# EAGLE design 3wire-1602-v0 (EAGLE 5.07)
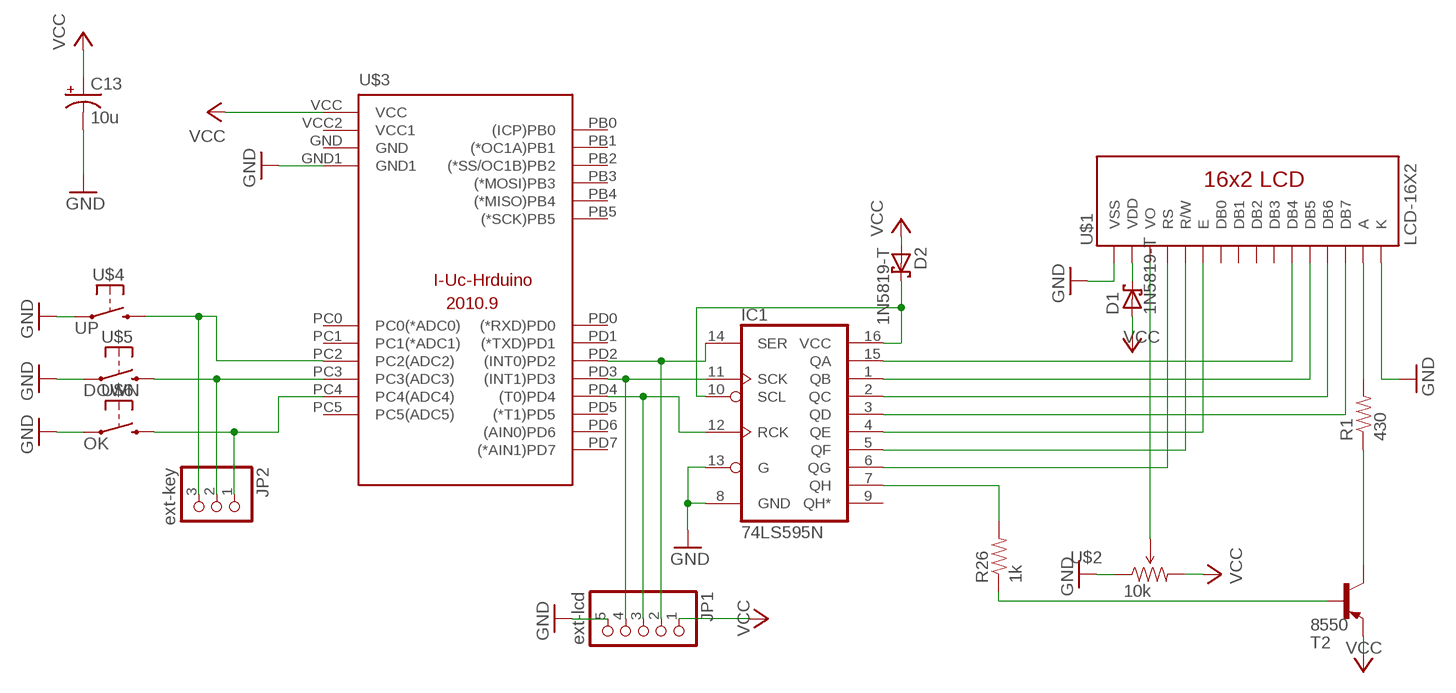
[diagram p0: schematic, sheet 1]

## Parts
C13  10u  CAP_POLPTH1  [CPOL-RADIAL-100UF-25V]
D1  1N5819-T  [DO41-7.6]
D2  1N5819-T  [DO41-7.6]
IC1  74LS595N  [DIL16]
JP1  ext-lcd  PINHD-1X5/90  [1X05/90]
JP2  ext-key  PINHD-1X3/90-LOCK  [1X03/90_LOCK]
R1  430  RESISTOR1/4W  [AXIAL-0.3]
R26  1k  RESISTOR0805  [0805]
T2  8550  -PNP-TO92-EBC  [TO92-EBC]
U$1  LCD-16X2  [LCD-16X2]
U$2  10k  TRIMPOTPTH  [TRIM_POT_PTH]
U$3  I-UC-V0/EXT-V0  [I-UC-V0-EXT-V0]
U$4  UP  TACT_SWITCH-2-PTH  [ALPS-SKHV]
U$5  DOWN  TACT_SWITCH-2-PTH  [ALPS-SKHV]
U$6  OK  TACT_SWITCH-2-PTH  [ALPS-SKHV]

## Nets
GND: C13.2(-) IC1.8(GND) IC1.13(G) JP1.5 U$1.1(VSS) U$1.16(K) U$2.1(CCW) U$3.GND1 U$4.2 U$5.2 U$6.2
N$1: IC1.15(QA) U$1.11(DB4)
N$2: IC1.1(QB) U$1.12(DB5)
N$3: IC1.2(QC) U$1.13(DB6)
N$4: IC1.3(QD) U$1.14(DB7)
N$5: IC1.4(QE) U$1.6(E)
N$6: IC1.5(QF) U$1.5(R/W)
N$7: IC1.6(QG) U$1.4(RS)
N$8: IC1.7(QH) R26.2
N$10: IC1.14(SER) JP1.2 U$3.PD2((INT0)PD2)
N$11: IC1.11(SCK) JP1.4 U$3.PD3((INT1)PD3)
N$12: IC1.12(RCK) JP1.3 U$3.PD4((T0)PD4)
N$13: JP2.3 U$3.PC2(PC2(ADC2)) U$4.3
N$14: JP2.2 U$3.PC3(PC3(ADC3)) U$5.3
N$15: U$1.3(VO) U$2.2(WIPER)
N$16: R1.P$2 U$1.15(A)
N$17: JP2.1 U$3.PC4(PC4(ADC4)) U$6.3
N$18: D1.C U$1.2(VDD)
N$19: R1.P$1 T2.C
N$21: D2.C IC1.10(SCL) IC1.16(VCC)
N$55: R26.1 T2.B
VCC: C13.1(+) D1.A D2.A JP1.1 T2.E U$2.3(CW) U$3.VCC
Unconnected: IC1.9(QH*) U$1.7(DB0) U$1.8(DB1) U$1.9(DB2) U$1.10(DB3) U$3.GND U$3.PB0((ICP)PB0) U$3.PB1((*OC1A)PB1) U$3.PB2((*SS/OC1B)PB2) U$3.PB3((*MOSI)PB3) U$3.PB4((*MISO)PB4) U$3.PB5((*SCK)PB5) U$3.PC0(PC0(*ADC0)) U$3.PC1(PC1(*ADC1)) U$3.PC5(PC5(ADC5)) U$3.PD0((*RXD)PD0) U$3.PD1((*TXD)PD1) U$3.PD5((*T1)PD5) U$3.PD6((AIN0)PD6) U$3.PD7((*AIN1)PD7) U$3.VCC2(VCC1)

## Library data of the parts
C13 = SparkFun:CAP_POL: Capacitor Polarized These are standard SMD and PTH capacitors. Normally 10uF, 47uF, and 100uF in electrolytic and tantalum varieties. Always verify the external diameter of the through hole cap, it varies with capacity, voltage, and manufacturer. The EIA devices should be standard.
D1 D2 = digital-toy:1N581*: 1.0A SCHOTTKY BARRIER RECTIFIER Source: http://www.diodes.com/datasheets/ds23001.pdf
IC1 = SparkFun:74*595: 8-bit SHIFT REGISTER, output latch
JP1 = pinhead:PINHD-1X5: PIN HEADER
JP2 = digital-toy:PINHD-1X3: PIN HEADER
R1 R26 = digital-toy:RESISTOR: Resistor Basic schematic elements and footprints for 0603, 1206, and PTH 1/10th watt (small) resistors. digital-toy copy vertical mount of axial-0.3 from rcl.lbr : the 0207/xx
T2 = digital-toy:*-PNP-: PNP Transistror
U$1 = digital-toy:LCD-16X2
U$2 = SparkFun:TRIMPOT
U$3 = digital-toy:I-UC-V0
U$4-U$6 = digital-toy:TACT_SWITCH-2

## Board
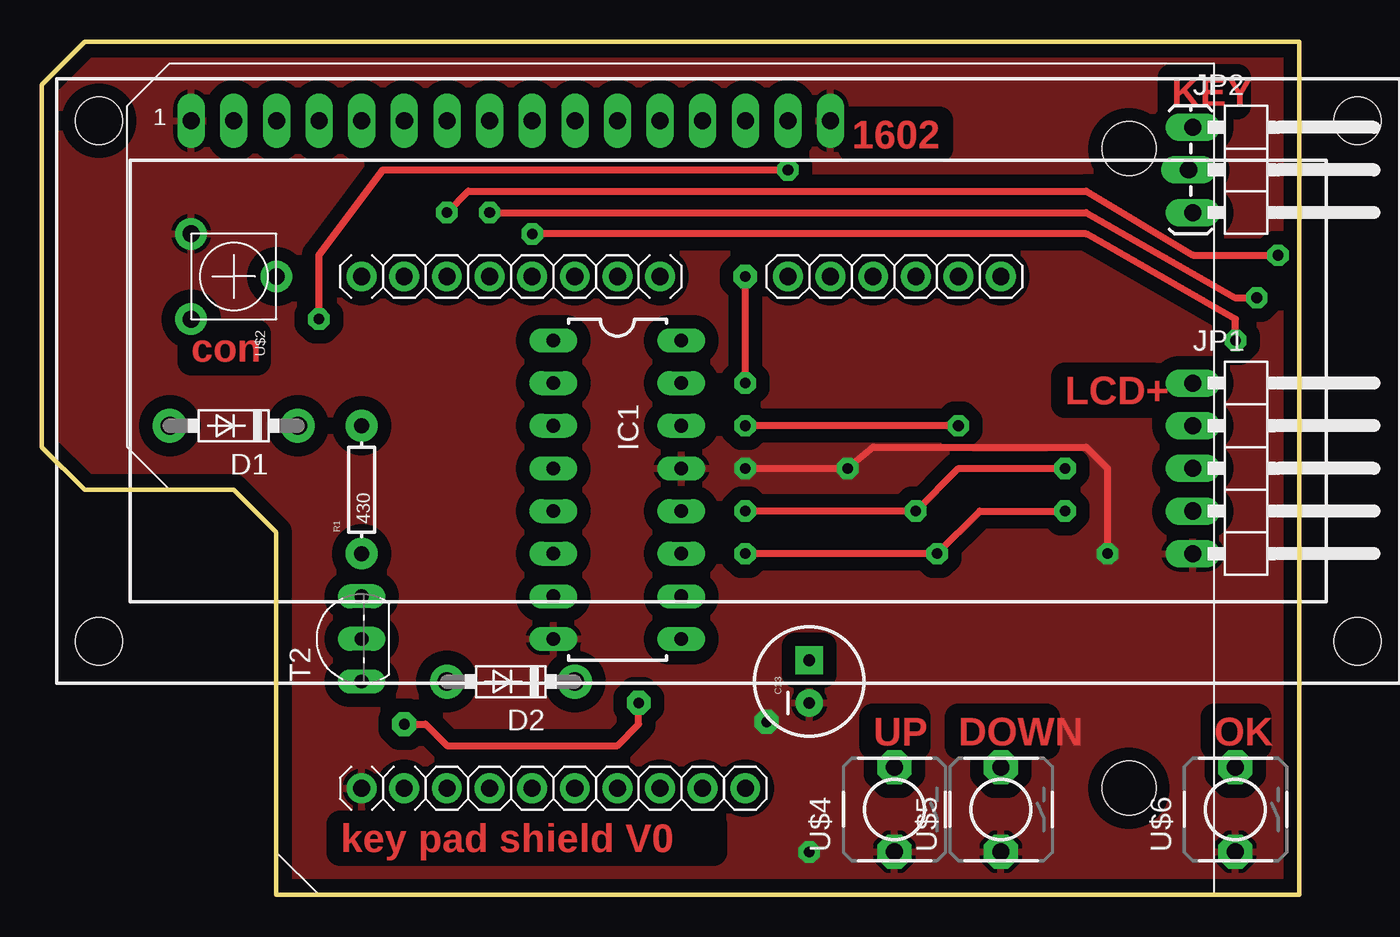
[diagram p1: board, top side]
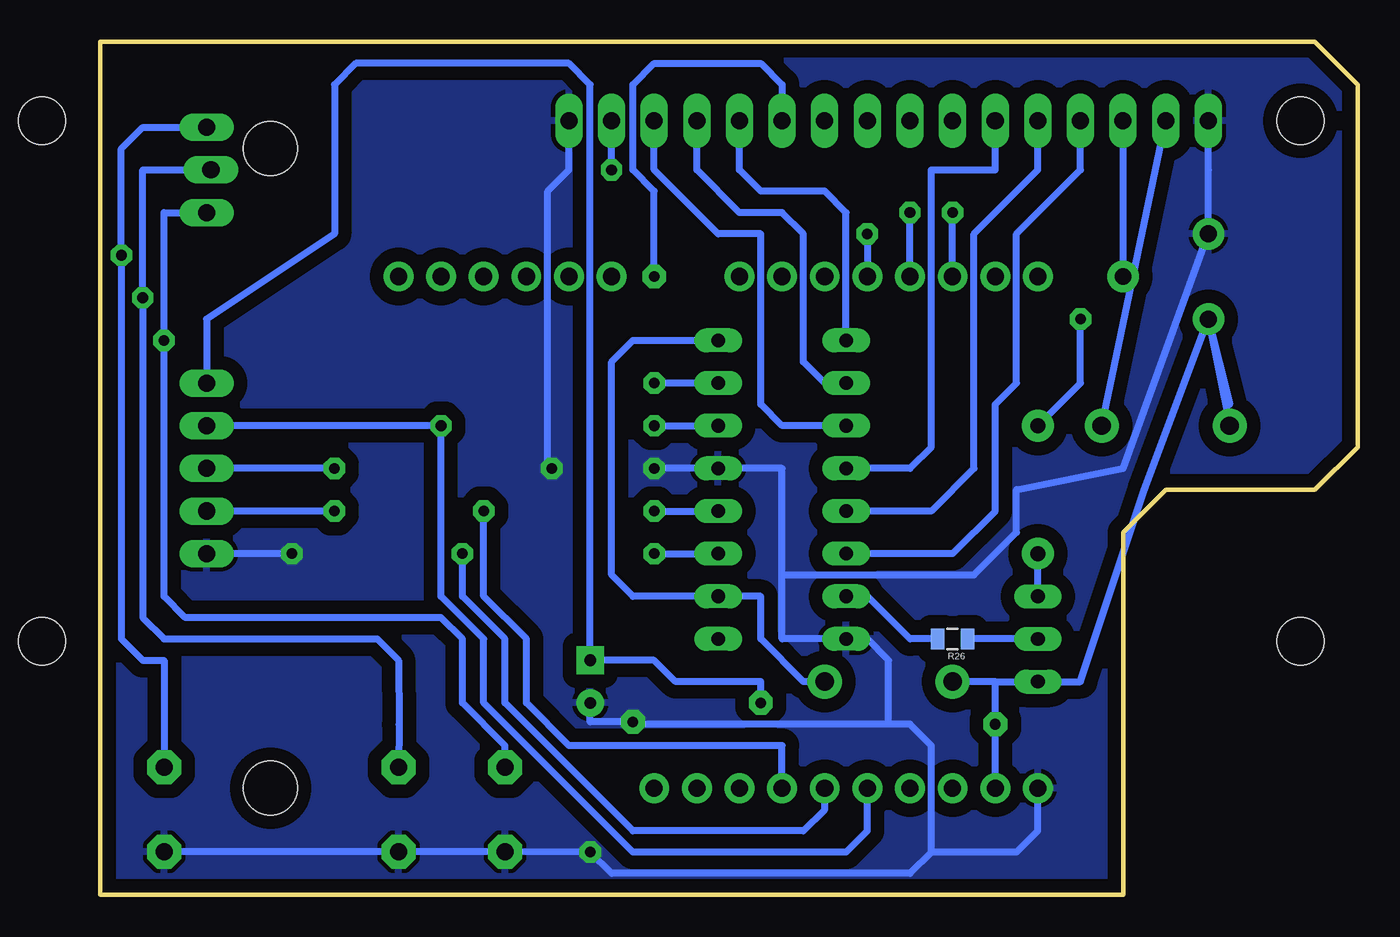
[diagram p2: board, bottom side, seen from below]

Size 74.93 x 50.8 mm. Coordinates in mm from the lower left corner, seen from the top.
Outline: 13.97,0 74.93,0 74.93,50.8 2.54,50.8 0,48.26 0,26.67 2.54,24.13 11.43,24.13 13.97,21.59 13.97,0
Copper layers (1*16): Top 0.035mm / dielectric 1.5mm / Bottom 0.035mm
Design rules "SparkFun": minimum track width 8mil, minimum drill 20mil, track to track 8mil, track to pad 8mil, pad to pad 8mil, via to via 8mil, smd to smd 8mil, copper to edge 10mil, drill to drill 8mil, minimum pad ring 12mil, minimum via ring 10mil, stop-mask expansion 4mil, vias tented up to drill 25mil, thermal gap 10mil

### Footprints (pad centres in the part's own frame; a part is rotated, then mirrored left to right if it is on the bottom)
CPOL-RADIAL-100UF-25V = drill 0.7 pad 1.651 square: 1 1.27,0 | drill 0.7 pad 1.651 round: 2 -1.27,0
DO41-7.6 = drill 1.1 pad 2.032 round: A 3.81,0; C -3.81,0
DIL16 = drill 0.813 long: 1 -8.89,-3.81; 2 -6.35,-3.81; 3 -3.81,-3.81; 4 -1.27,-3.81; 5 1.27,-3.81; 6 3.81,-3.81; 7 6.35,-3.81; 8 8.89,-3.81; 9 8.89,3.81; 10 6.35,3.81; 11 3.81,3.81; 12 1.27,3.81; 13 -1.27,3.81; 14 -3.81,3.81; 15 -6.35,3.81; 16 -8.89,3.81
1X05/90 = drill 1.016 long: 1 -5.08,-3.81; 2 -2.54,-3.81; 3 0,-3.81; 4 2.54,-3.81; 5 5.08,-3.81
1X03/90_LOCK = drill 1.016 long: 1 -2.54,-3.81; 2 0,-4.064; 3 2.54,-3.81
AXIAL-0.3 = drill 0.9 pad 1.88 round: P$1 -3.81,0; P$2 3.81,0
0805 = smd 0.8 x 1.2: 1 -0.9,0; 2 0.9,0
TO92-EBC = drill 0.813 long: B 0,-1.27; C 2.54,-1.27; E -2.54,-1.27
LCD-16X2 = drill 1.016 long: 1 -32,15.5; 2 -29.46,15.5; 3 -26.92,15.5; 4 -24.38,15.5; 5 -21.84,15.5; 6 -19.3,15.5; 7 -16.76,15.5; 8 -14.22,15.5; 9 -11.68,15.5; 10 -9.14,15.5; 11 -6.6,15.5; 12 -4.06,15.5; 13 -1.52,15.5; 14 1.02,15.5; 15 3.56,15.5; 16 6.1,15.5 | hole 2.8: -37.5,15.5; -37.5,-15.5; 37.5,15.5; 37.5,-15.5
TRIM_POT_PTH = drill 1 pad 1.88 round: 1 -2.54,-2.54; 2 0,2.54; 3 2.54,-2.54
I-UC-V0-EXT-V0 = drill 1.016 pad 1.778 round: GND 48.26,36.83; GND1 30.48,6.35; PB0 68.58,36.83; PB1 66.04,36.83; PB2 63.5,36.83; PB3 60.96,36.83; PB4 58.42,36.83; PB5 55.88,36.83; PC0 45.72,36.83; PC1 43.18,36.83; PC2 40.64,36.83; PC3 38.1,36.83; PC4 35.56,36.83; PC5 33.02,36.83; PD0 35.56,6.35; PD1 38.1,6.35; PD2 40.64,6.35; PD3 43.18,6.35; PD4 45.72,6.35; PD5 48.26,6.35; PD6 50.8,6.35; PD7 53.34,6.35; VCC 33.02,6.35; VCC2 30.48,36.83 | hole 3.2: 76.2,44.45; 76.2,6.35
ALPS-SKHV = drill 1.016 pad 2.032 octagon: 2 -2.51,0; 3 2.51,0

### Placement (x,y rotation side)
C13  45.72,12.7 90 top
D1  11.43,27.94 180 top
D2  27.94,12.7 180 top
IC1  34.29,24.13 270 top
JP1  72.39,25.4 270 top
JP2  72.39,43.18 270 top
R1  19.05,24.13 90 top
R26  24.13,15.24 180 bottom
T2  17.78,15.24 90 top
U$1  40.89,30.61 0 top
U$2  11.43,36.83 270 top
U$3  -11.43,0 0 top
U$4  50.8,5.08 90 top
U$5  57.15,5.08 90 top
U$6  71.12,5.08 90 top

### Tracks (layer width: path | path; a pad name or v marks a point on that pad's centre or on a via)
GND  (via drill 0.64 pad 1.27, 0.64 pad 1.42)
  Top 0.406: v41.91,25.4 v48.01,25.4 49.53,26.67 62.23,26.67 63.5,25.4 v63.5,20.32
  Bottom 0.406: C13.2 45.72,10.3 v43.18,10.3 43.04,10.16 27.94,10.16 | 34.29,19.05 34.29,15.24 IC1.8 29.21,15.24 27.94,13.97 27.94,10.16 | 34.29,19.05 34.29,25.4 IC1.13 v41.91,25.4 | U$1.16 46.99,43.18 48.26,41.91 48.26,25.65 v48.01,25.4 | U$3.GND1 19.05,3.81 20.32,2.54 25.4,2.54 | U$6.2 U$5.2 U$4.2 v45.72,2.54 44.45,1.27 26.67,1.27 25.4,2.54 | 34.29,19.05 22.86,19.05 20.32,21.59 20.32,24.13 13.97,25.4 U$2.1 8.89,43.18 U$1.1 | v63.5,20.32 JP1.5 | 27.94,10.16 26.67,10.16 25.4,8.89 25.4,2.54
  pour Bottom (isolate 0.813): 86.36,55.88 85.09,2.54 83.82,2.54 81.28,-2.54 76.2,-10.16 3.81,-8.89 -7.62,-6.35 -8.89,52.07 2.54,55.88
  pour Top (isolate 0.813): -6.35,58.42 90.17,59.69 90.17,6.35 83.82,-6.35 -2.54,-5.08 -6.35,6.35
N$1  (via drill 0.64 pad 1.27, 0.64 pad 1.42)
  Top 0.406: v41.91,30.48 v41.91,36.83
  Bottom 0.406: IC1.15 v41.91,30.48 | v41.91,36.83 41.91,41.91 43.18,43.18 43.18,48.26 41.91,49.53 35.56,49.53 34.29,48.26 U$1.11
N$2
  Bottom 0.406: IC1.1 30.48,40.64 31.75,41.91 35.56,41.91 36.83,43.18 U$1.12
N$3
  Bottom 0.406: IC1.2 31.75,30.48 33.02,31.75 33.02,39.37 34.29,40.64 36.83,40.64 39.37,43.18 U$1.13
N$4
  Bottom 0.406: IC1.3 34.29,27.94 35.56,29.21 35.56,39.37 38.1,39.37 41.91,43.18 U$1.14
N$5
  Bottom 0.406: IC1.4 26.67,25.4 25.4,26.67 25.4,43.18 21.59,43.18 U$1.6
N$6
  Bottom 0.406: IC1.5 25.4,22.86 22.86,25.4 22.86,39.37 19.05,43.18 U$1.5
N$7
  Bottom 0.406: IC1.6 24.13,20.32 21.59,22.86 21.59,29.21 20.32,30.48 20.32,39.37 16.51,43.18 U$1.4
N$8
  Bottom 0.406: IC1.7 29.21,17.78 26.67,15.24 R26.2
N$10  (via drill 0.64 pad 1.27)
  Top 0.406: v54.61,27.94 v41.91,27.94
  Bottom 0.406: v41.91,27.94 IC1.14 | JP1.2 v54.61,27.94 54.61,17.78 52.07,15.24 52.07,11.43 43.18,2.54 30.48,2.54 29.21,3.81 U$3.PD2
N$11  (via drill 0.64 pad 1.27)
  Top 0.406: v41.91,20.32 v53.34,20.32 55.88,22.86 v60.96,22.86
  Bottom 0.406: v41.91,20.32 IC1.11 | v60.96,22.86 JP1.4 | v53.34,20.32 53.34,17.78 50.8,15.24 50.8,11.43 43.18,3.81 33.02,3.81 31.75,5.08 U$3.PD3
N$12  (via drill 0.64 pad 1.27)
  Top 0.406: v41.91,22.86 v52.07,22.86 54.61,25.4 v60.96,25.4
  Bottom 0.406: U$3.PD4 34.29,8.89 46.99,8.89 49.53,11.43 49.53,15.24 52.07,17.78 v52.07,22.86 | v41.91,22.86 IC1.12 | v60.96,25.4 JP1.3
N$13  (via drill 0.64 pad 1.27)
  Top 0.406: v29.21,39.37 62.23,39.37 71.12,34.29 v71.12,33.02
  Bottom 0.406: v29.21,39.37 U$3.PC2 | U$4.3 50.8,8.89 53.34,11.43 53.34,15.24 54.61,16.51 69.85,16.51 71.12,17.78 v71.12,33.02 71.12,40.64 JP2.3
N$14  (via drill 0.64 pad 1.27)
  Top 0.406: v26.67,40.64 62.23,40.64 71.12,35.56 v72.39,35.56
  Bottom 0.406: U$5.3 57.12,10.13 57.15,13.97 58.42,15.24 71.12,15.24 72.39,16.51 v72.39,35.56 72.39,43.18 JP2.2 | U$3.PC3 v26.67,40.64
N$15
  Bottom 0.406: U$1.3 13.97,43.18 U$2.2
N$16  (via drill 0.64 pad 1.27)
  Top 0.406: v16.51,34.29 16.51,38.1 20.32,43.18 v44.45,43.18
  Bottom 0.406: R1.P$2 16.51,30.48 v16.51,34.29 | v44.45,43.18 44.45,44.45 U$1.15
N$17  (via drill 0.64 pad 1.27)
  Top 0.406: v73.66,38.1 68.58,38.1 62.23,41.91 25.4,41.91 v24.13,40.64
  Bottom 0.406: U$3.PC4 v24.13,40.64 | U$6.3 71.12,13.97 72.39,13.97 73.66,15.24 v73.66,38.1 73.66,44.45 72.39,45.72 JP2.1
N$18
  Bottom 0.406: D1.C U$1.2
N$19
  Bottom 0.406: T2.C R1.P$1
N$21
  Bottom 0.406: D2.C 33.02,12.7 35.56,15.24 35.56,17.78 IC1.10 43.18,17.78 44.45,19.05 44.45,31.75 43.18,33.02 IC1.16
N$55
  Bottom 0.406: T2.B R26.1
VCC  (via drill 0.64 pad 1.42)
  Top 0.406: v21.59,10.16 22.86,10.16 24.13,8.89 34.29,8.89 35.56,10.16 v35.56,11.43
  Bottom 0.406: U$3.VCC v21.59,10.16 21.59,12.7 | v35.56,11.43 35.56,12.7 40.64,12.7 41.91,13.97 C13.1 45.72,48.26 46.99,49.53 59.69,49.53 60.96,48.26 60.96,39.37 68.58,34.29 JP1.1 | U$2.3 12.7,24.13 16.51,12.7 T2.E 21.59,12.7 | U$2.3 7.62,29.21 | U$2.3 D1.A | 21.59,12.7 D2.A

### Text on the board
Top: KEY | 1602 | con | LCD+ | UP | DOWN | OK | key pad shield V0